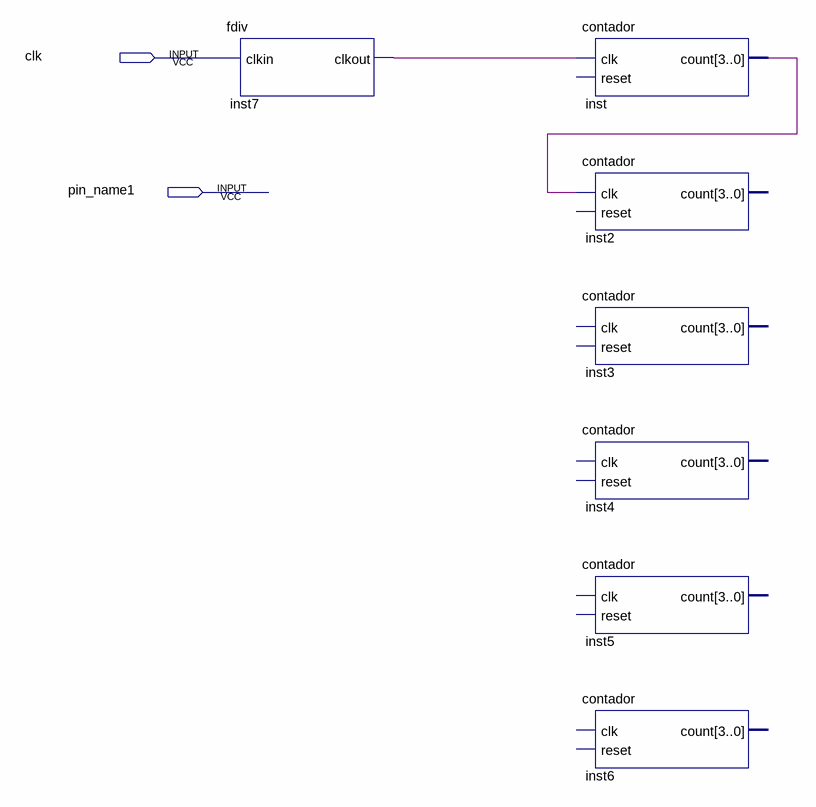
[diagram p0: schematic sheet]
// Quartus schematic cronometro_dois.bdf as structural Verilog: 7 symbols, 2 pins
module cronometro_dois (
  input  clk,
  input  pin_name1
);

  wire inst7_clkout, inst_count;

  fdiv inst7 (.clkin(clk), .clkout(inst7_clkout));
  contador inst (.clk(inst7_clkout), .count(inst_count));  // open: reset
  contador inst2 (.clk(inst_count));  // open: reset, count
  contador inst3 ();  // open: clk, reset, count
  contador inst4 ();  // open: clk, reset, count
  contador inst5 ();  // open: clk, reset, count
  contador inst6 ();  // open: clk, reset, count
endmodule
